# EAGLE design comcon_ps2_joy_adapter (EAGLE 6.5.0)
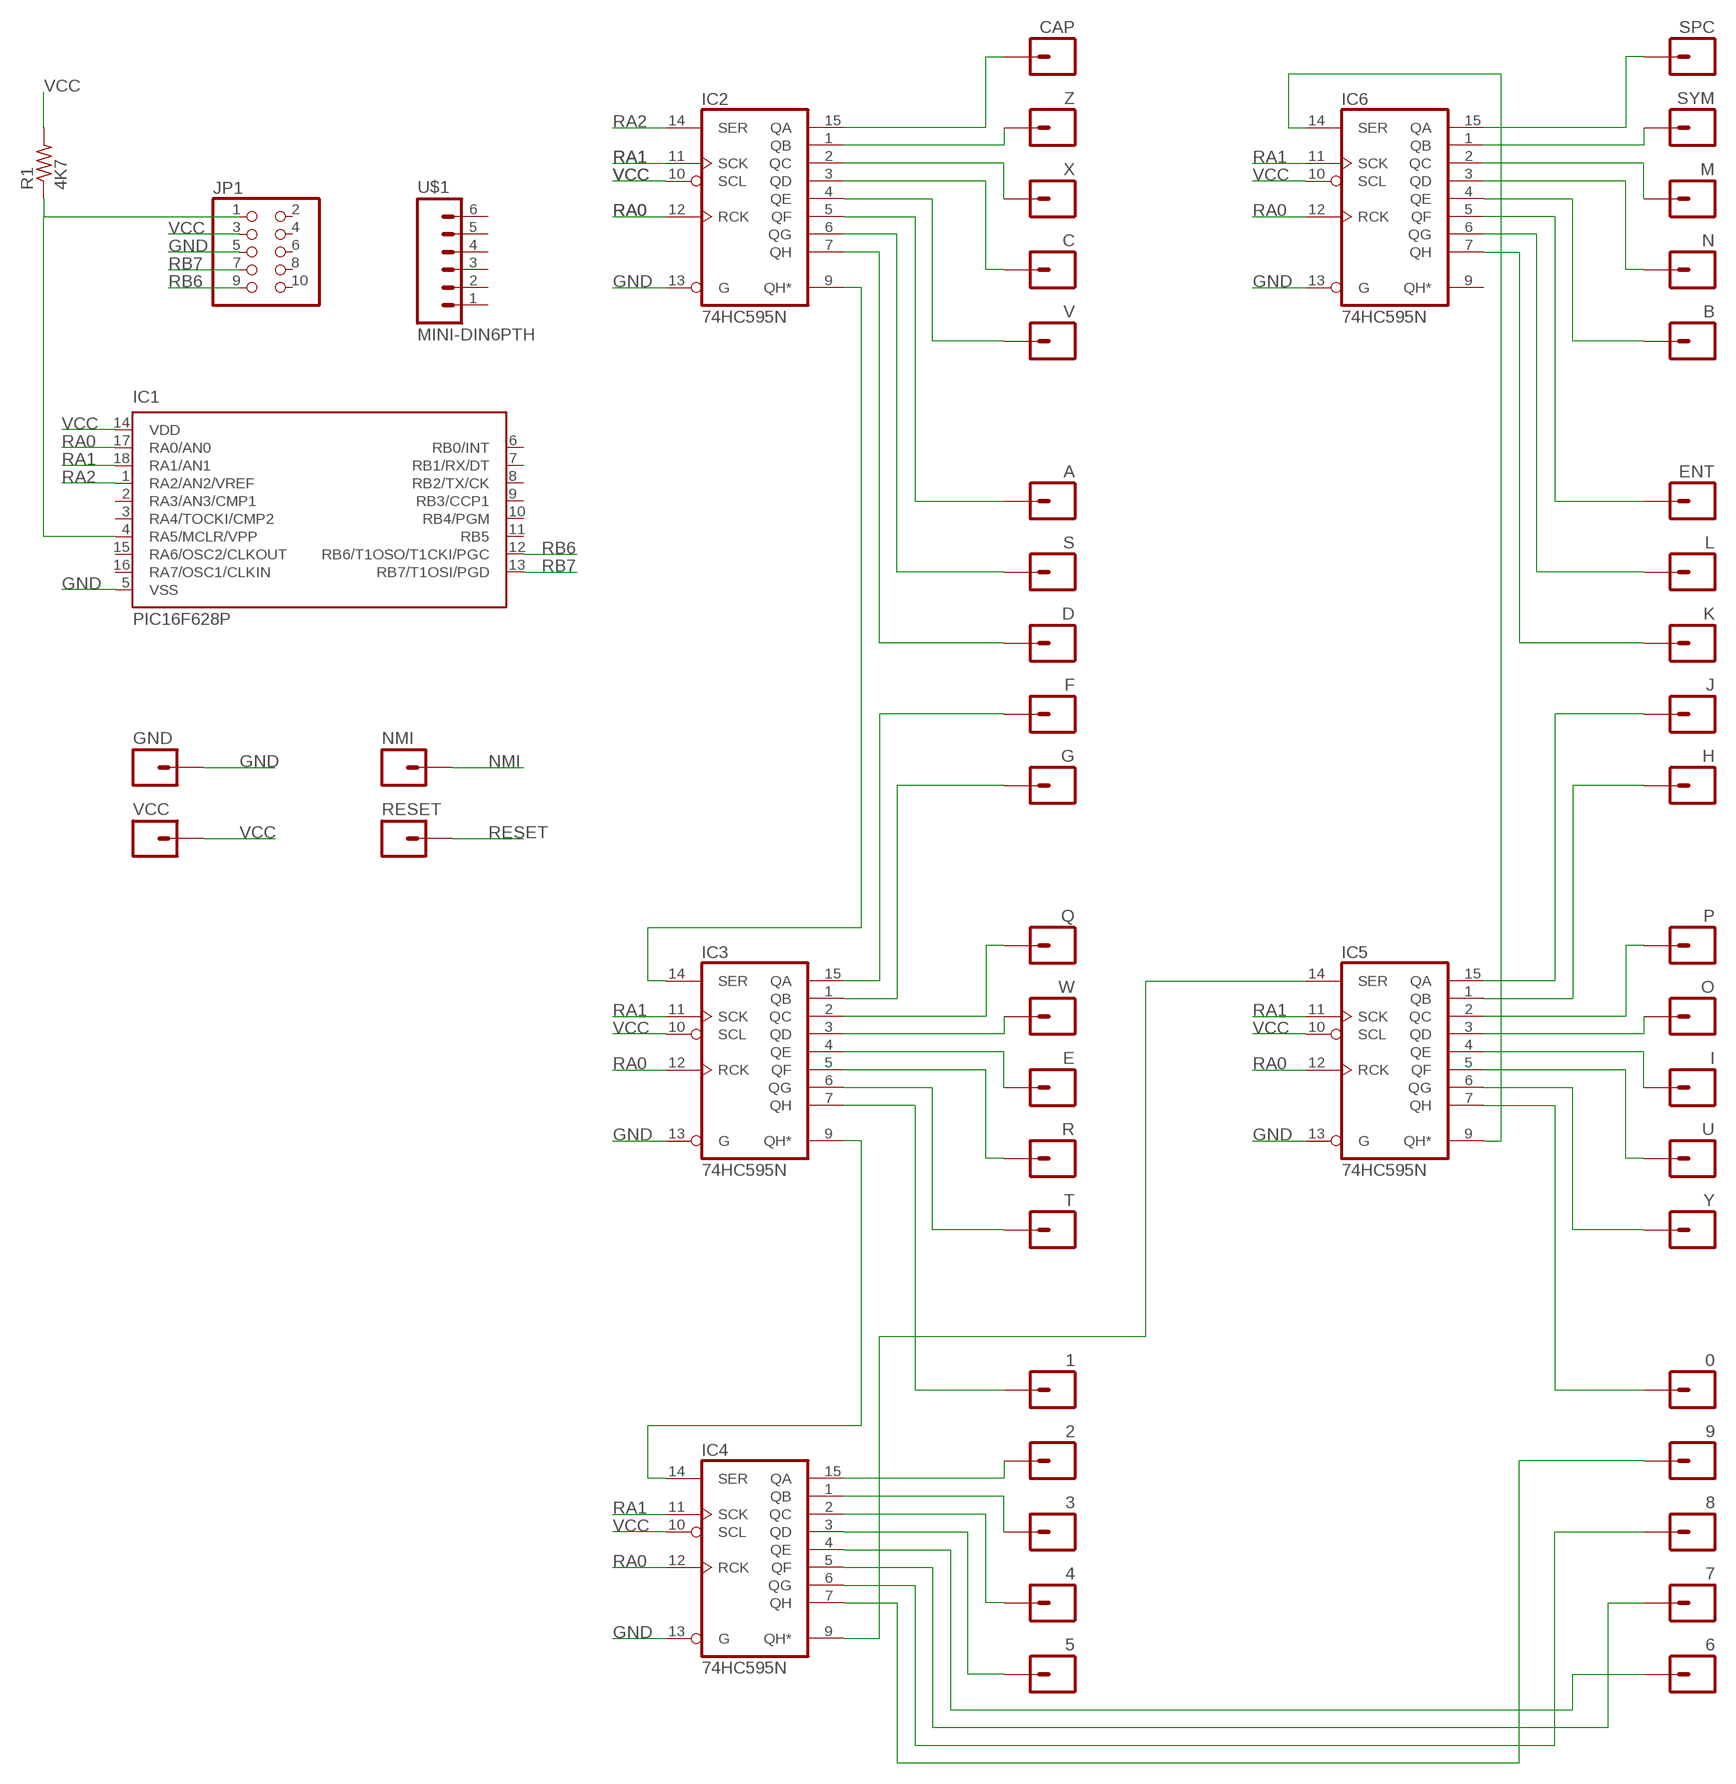
[diagram p0: schematic, sheet 1]

## Parts
0  M01PTH  [1X01]
1  M01PTH  [1X01]
2  M01PTH  [1X01]
3  M01PTH  [1X01]
4  M01PTH  [1X01]
5  M01PTH  [1X01]
6  M01PTH  [1X01]
7  M01PTH  [1X01]
8  M01PTH  [1X01]
9  M01PTH  [1X01]
A  M01PTH  [1X01]
B  M01PTH  [1X01]
C  M01PTH  [1X01]
CAP  M01PTH  [1X01]
D  M01PTH  [1X01]
E  M01PTH  [1X01]
ENT  M01PTH  [1X01]
F  M01PTH  [1X01]
G  M01PTH  [1X01]
GND  M01PTH  [1X01]
H  M01PTH  [1X01]
I  M01PTH  [1X01]
IC1  PIC16F628P  [DIL18]
IC2  74HC595N  [DIL16]
IC3  74HC595N  [DIL16]
IC4  74HC595N  [DIL16]
IC5  74HC595N  [DIL16]
IC6  74HC595N  [DIL16]
J  M01PTH  [1X01]
JP1  PINHD-2X5  [2X05]
K  M01PTH  [1X01]
L  M01PTH  [1X01]
M  M01PTH  [1X01]
N  M01PTH  [1X01]
NMI  M01PTH  [1X01]
O  M01PTH  [1X01]
P  M01PTH  [1X01]
Q  M01PTH  [1X01]
R  M01PTH  [1X01]
R1  4K7  R-US_0207/7  [0207/7]
RESET  M01PTH  [1X01]
S  M01PTH  [1X01]
SPC  M01PTH  [1X01]
SYM  M01PTH  [1X01]
T  M01PTH  [1X01]
U  M01PTH  [1X01]
U$1  MINI-DIN6PTH  [MINI-DIN6]
V  M01PTH  [1X01]
VCC  M01PTH  [1X01]
W  M01PTH  [1X01]
X  M01PTH  [1X01]
Y  M01PTH  [1X01]
Z  M01PTH  [1X01]

## Nets
GND [power]: GND.1 IC1.5(VSS) IC2.13(G) IC3.13(G) IC4.13(G) IC5.13(G) IC6.13(G) JP1.5
N$1: A.1 IC2.5(QF)
N$2: IC6.15(QA)
N$3: IC2.6(QG) S.1
N$4: IC2.9(QH*) IC3.14(SER)
N$5: IC5.9(QH*) IC6.14(SER)
N$6: IC3.9(QH*) IC4.14(SER)
N$7: IC4.9(QH*) IC5.14(SER)
N$8: IC1.4(RA5/MCLR/VPP) JP1.1 R1.1
N$12: IC6.1(QB) SYM.1
N$18: IC6.2(QC) M.1
N$20: IC6.3(QD) N.1
N$22: B.1 IC6.4(QE)
N$25: CAP.1 IC2.15(QA)
N$26: IC2.1(QB) Z.1
N$27: IC2.2(QC) X.1
N$28: C.1 IC2.3(QD)
N$47: IC2.4(QE) V.1
N$53: ENT.1 IC6.5(QF)
N$54: IC6.6(QG) L.1
N$55: IC6.7(QH) K.1
N$56: IC5.15(QA) J.1
N$57: H.1 IC5.1(QB)
N$65: D.1 IC2.7(QH)
N$66: F.1 IC3.15(QA)
N$67: G.1 IC3.1(QB)
N$74: IC5.2(QC)
N$75: IC5.3(QD) O.1
N$76: I.1 IC5.4(QE)
N$77: IC5.5(QF) U.1
N$78: IC5.6(QG) Y.1
N$84: IC3.2(QC)
N$85: IC3.3(QD) W.1
N$86: E.1 IC3.4(QE)
N$87: IC3.5(QF) R.1
N$88: IC3.6(QG) T.1
N$94: 0.1 IC5.7(QH)
N$95: 9.1 IC4.7(QH)
N$96: 8.1 IC4.6(QG)
N$97: 7.1 IC4.5(QF)
N$98: 6.1 IC4.4(QE)
N$104: 1.1 IC3.7(QH)
N$105: 2.1 IC4.15(QA)
N$106: 3.1 IC4.1(QB)
N$107: 4.1 IC4.2(QC)
N$108: 5.1 IC4.3(QD)
NMI: NMI.1
RA0: IC2.12(RCK) IC3.12(RCK) IC4.12(RCK) IC5.12(RCK) IC6.12(RCK)
RA1: IC2.11(SCK) IC3.11(SCK) IC4.11(SCK) IC5.11(SCK) IC6.11(SCK)
RA2: IC2.14(SER)
RB6: IC1.12(RB6/T1OSO/T1CKI/PGC)
RB7: IC1.13(RB7/T1OSI/PGD)
RESET: RESET.1
VCC [power]: IC2.10(SCL) IC3.10(SCL) IC4.10(SCL) IC5.10(SCL) IC6.10(SCL) JP1.3 R1.2 VCC.1
Unconnected: IC1.1(RA2/AN2/VREF) IC1.2(RA3/AN3/CMP1) IC1.3(RA4/TOCKI/CMP2) IC1.6(RB0/INT) IC1.7(RB1/RX/DT) IC1.8(RB2/TX/CK) IC1.9(RB3/CCP1) IC1.10(RB4/PGM) IC1.11(RB5) IC1.15(RA6/OSC2/CLKOUT) IC1.16(RA7/OSC1/CLKIN) IC1.17(RA0/AN0) IC1.18(RA1/AN1) IC6.9(QH*) JP1.2 JP1.4 JP1.6 JP1.7 JP1.8 JP1.9 JP1.10 P.1 Q.1 SPC.1 U$1.1 U$1.2 U$1.3 U$1.4 U$1.5 U$1.6

## Power pins joined to a net without a drawn wire
GND: IC2.8(GND) IC3.8(GND) IC4.8(GND) IC5.8(GND) IC6.8(GND)
VCC: IC2.16(VCC) IC3.16(VCC) IC4.16(VCC) IC5.16(VCC) IC6.16(VCC)
VDD: IC1.14(VDD)

## Library data of the parts
0 1-9 A B C CAP D E ENT F G GND H I J K L M N NMI O P Q R RESET S SPC SYM T U V VCC W X Y Z = SparkFun-Connectors:M01: Header 1 Standard 1-pin 0.1" header. Use with straight break away headers (SKU : PRT-00116), right angle break away headers (PRT-00553), swiss pins (PRT-00743), machine pins (PRT-00117), and female headers (PRT-00115).
IC1 = microchip:PIC16F62*: FLASH-Based 8-Bit CMOS Microcontroller Source: http://ww1.microchip.com/downloads/en/DeviceDoc/40300C.pdf; MF: MICROCHIP; MPN: PIC16F628-04I/P; OC_FARNELL: 9760407; OC_NEWARK: 19C7272
IC2-IC6 = 74xx-eu:74*595: 8-bit SHIFT REGISTER, output latch
JP1 = pinhead:PINHD-2X5: PIN HEADER
R1 = resistor:R-US_: RESISTOR, American symbol
U$1 = SparkFun-Connectors:MINI-DIN6: mini DIN 6 Connector Commonly found on the back of a computer for PS2 keyboard and mice. Schematic and footprint are proven. Spark Fun Electronics SKU : PRT-08509

## Net classes
1 power: width 0.508 mm, clearance 0.254 mm to class 0, clearance 0.254 mm

## Board
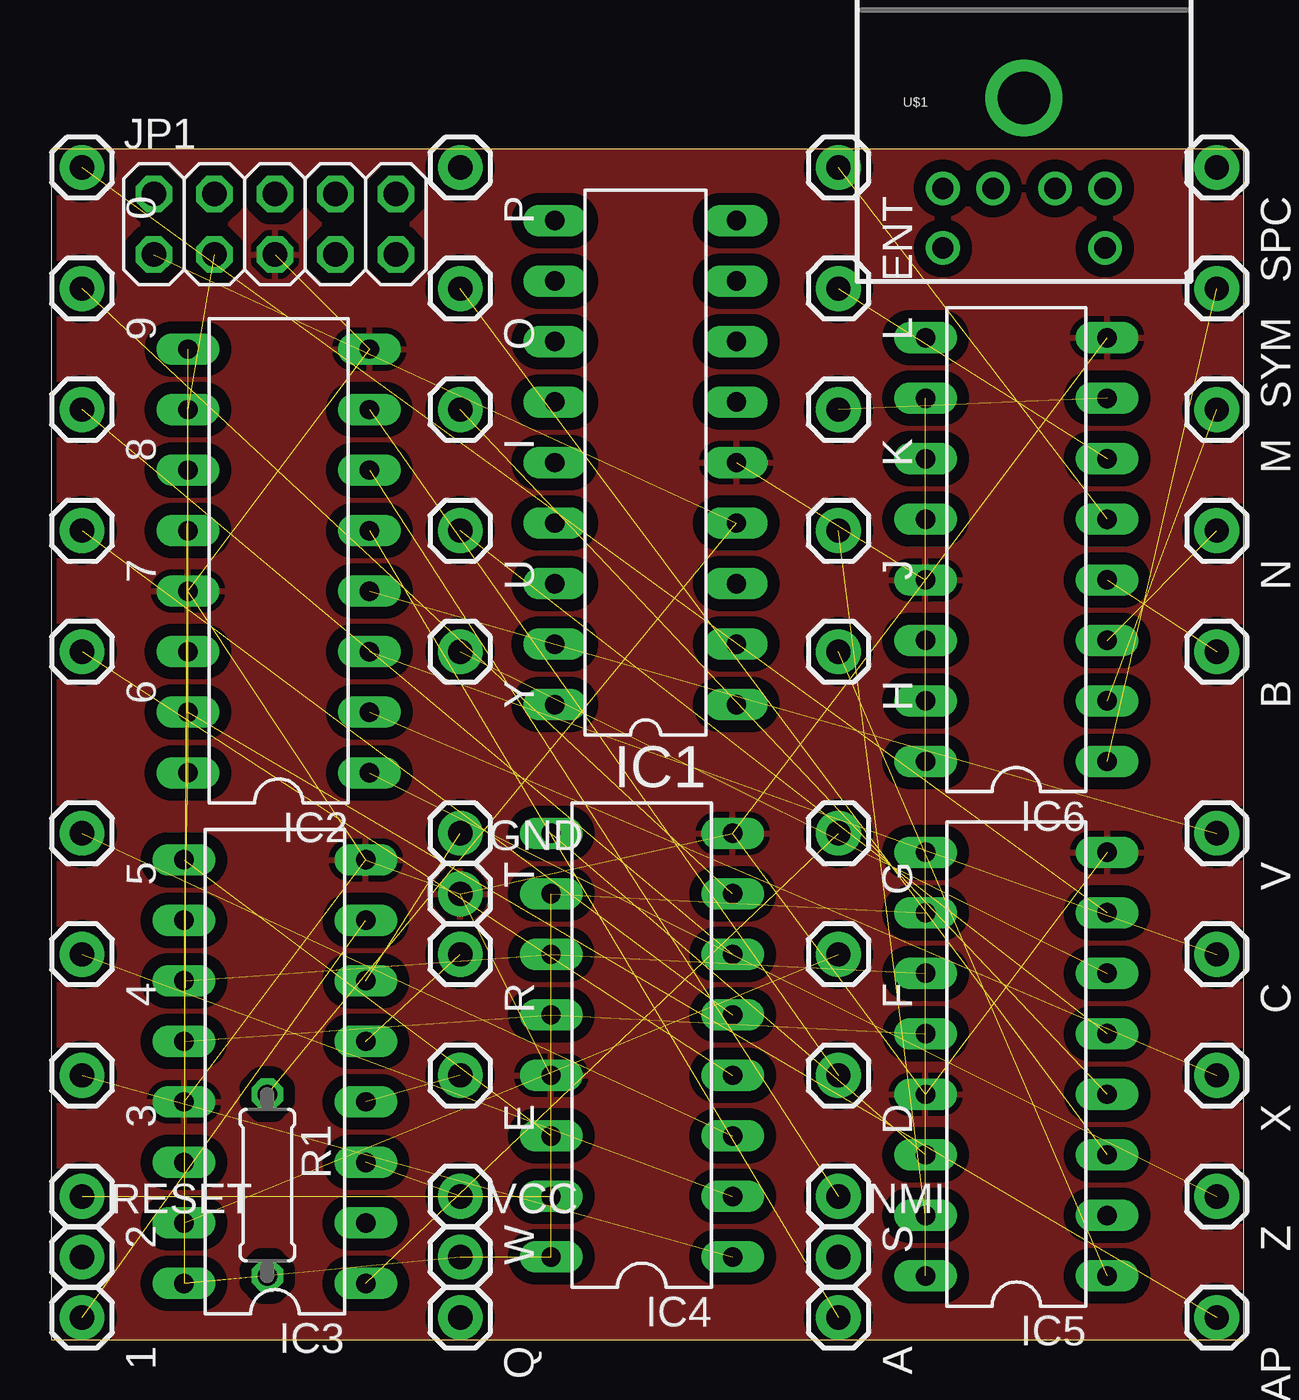
[diagram p1: board, top side]
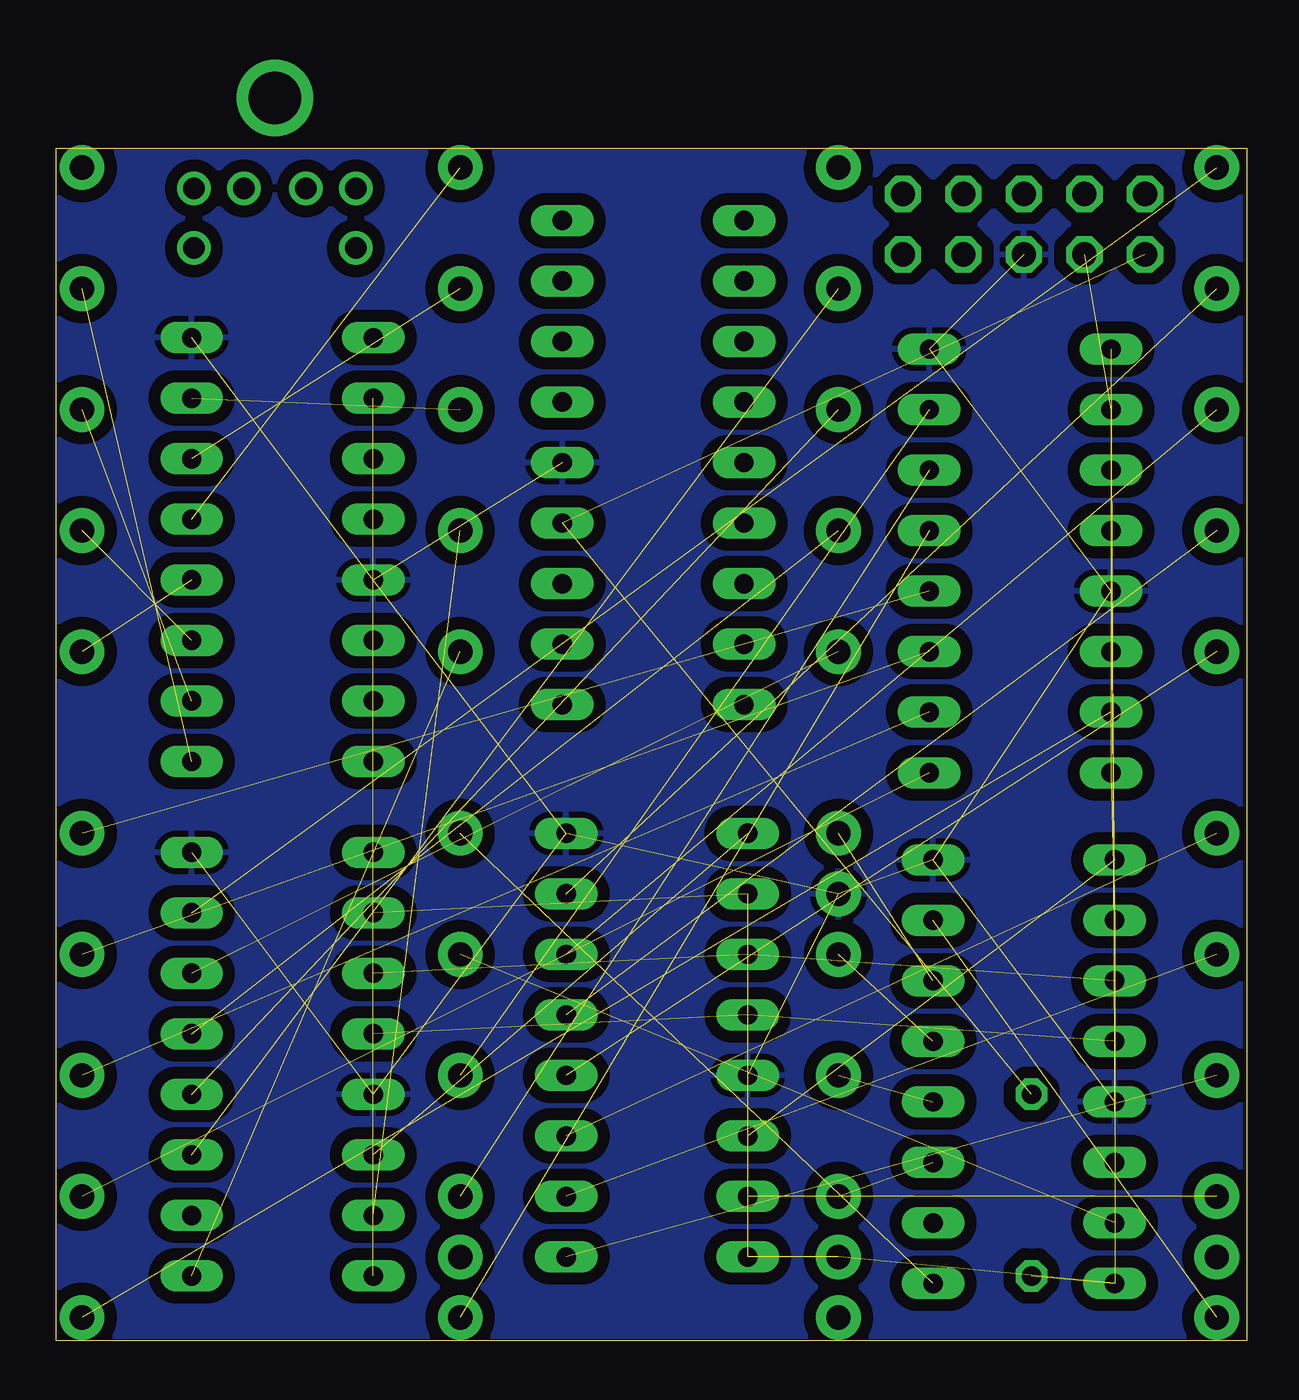
[diagram p2: board, bottom side, seen from below]

No outline drawn. Coordinates in mm, seen from the top.
Copper layers (1*16): Top 0.035mm / dielectric 1.5mm / Bottom 0.035mm
Design rules "seedstudio_Fusion_eagle_rule_v1.1 *": minimum track width 7mil, minimum drill 12mil, track to track 8mil, track to pad 10mil, pad to pad 6mil, via to via 10mil, smd to smd 0mil, copper to edge 10mil, drill to drill 10mil, minimum pad ring 10mil, minimum via ring 6mil, stop-mask expansion 2mil, vias tented up to drill 100mil, thermal gap 10mil
Milling: 4 lines

### Footprints (pad centres in the part's own frame; a part is rotated, then mirrored left to right if it is on the bottom)
1X01 = drill 1.016 pad 1.88: 1 0,0
DIL18 = drill 0.813 long: 1 -10.16,-3.81; 2 -7.62,-3.81; 3 -5.08,-3.81; 4 -2.54,-3.81; 5 0,-3.81; 6 2.54,-3.81; 7 5.08,-3.81; 8 7.62,-3.81; 9 10.16,-3.81; 10 10.16,3.81; 11 7.62,3.81; 12 5.08,3.81; 13 2.54,3.81; 14 0,3.81; 15 -2.54,3.81; 16 -5.08,3.81; 17 -7.62,3.81; 18 -10.16,3.81
DIL16 = drill 0.813 long: 1 -8.89,-3.81; 2 -6.35,-3.81; 3 -3.81,-3.81; 4 -1.27,-3.81; 5 1.27,-3.81; 6 3.81,-3.81; 7 6.35,-3.81; 8 8.89,-3.81; 9 8.89,3.81; 10 6.35,3.81; 11 3.81,3.81; 12 1.27,3.81; 13 -1.27,3.81; 14 -3.81,3.81; 15 -6.35,3.81; 16 -8.89,3.81
2X05 = drill 1.016 octagon: 1 -5.08,-1.27; 2 -5.08,1.27; 3 -2.54,-1.27; 4 -2.54,1.27; 5 0,-1.27; 6 0,1.27; 7 2.54,-1.27; 8 2.54,1.27; 9 5.08,-1.27; 10 5.08,1.27
0207/7 = drill 0.813 octagon: 1 -3.81,0; 2 3.81,0
MINI-DIN6 = drill 0.9: 1 -1.3,-8.5; 2 1.3,-8.5; 3 -3.4,-8.5; 4 3.4,-8.5; 5 -3.4,-11; 6 3.4,-11 | drill 2.2: P$1 0,-4.7

### Placement (x,y rotation side)
0  1.27,49.21 270 top
1  1.27,0.95 270 top
2  1.27,6.03 270 top
3  1.27,11.11 270 top
4  1.27,16.19 270 top
5  1.27,21.27 270 top
6  1.27,28.89 270 top
7  1.27,33.97 270 top
8  1.27,39.05 270 top
9  1.27,44.13 270 top
A  33.02,0.95 270 top
B  48.9,28.89 270 top
C  48.9,16.19 270 top
CAP  48.9,0.95 270 top
D  33.02,11.11 270 top
E  17.14,11.11 270 top
ENT  33.02,49.21 270 top
F  33.02,16.19 270 top
G  33.02,21.27 270 top
GND  17.14,18.73 0 top
H  33.02,28.89 270 top
I  17.14,39.05 270 top
IC1  24.92,36.83 90 top
IC2  9.53,32.7 90 top
IC3  9.37,11.27 90 top
IC4  24.77,12.38 90 top
IC5  40.48,11.59 90 top
IC6  40.48,33.18 90 top
J  33.02,33.97 270 top
JP1  9.37,46.83 0 top
K  33.02,39.05 270 top
L  33.02,44.13 270 top
M  48.9,39.05 270 top
N  48.9,33.97 270 top
NMI  33.02,3.49 0 top
O  17.14,44.13 270 top
P  17.14,49.21 270 top
Q  17.14,0.95 270 top
R  17.14,16.19 270 top
R1  9.05,6.51 270 top
RESET  1.27,3.49 0 top
S  33.02,6.03 270 top
SPC  48.9,49.21 270 top
SYM  48.9,44.13 270 top
T  17.14,21.27 270 top
U  17.14,33.97 270 top
U$1  40.8,56.83 0 top
V  48.9,21.27 270 top
VCC  17.14,3.49 0 top
W  17.14,6.03 270 top
X  48.9,11.11 270 top
Y  17.14,28.89 270 top
Z  48.9,6.03 270 top

### Tracks (layer width: path | path; a pad name or v marks a point on that pad's centre or on a via)
GND  (12 unrouted)
  pour Top (isolate 0.508): 0.32,0.16 49.85,0.16 49.85,49.85 0.32,49.85
  pour Bottom (isolate 0.508): 0.32,0.16 49.85,0.16 49.85,49.85 0.32,49.85
N$1  (1 unrouted)
N$3  (1 unrouted)
N$4  (1 unrouted)
N$5  (1 unrouted)
N$6  (1 unrouted)
N$7  (1 unrouted)
N$8  (2 unrouted)
N$12  (1 unrouted)
N$18  (1 unrouted)
N$20  (1 unrouted)
N$22  (1 unrouted)
N$25  (1 unrouted)
N$26  (1 unrouted)
N$27  (1 unrouted)
N$28  (1 unrouted)
N$47  (1 unrouted)
N$53  (1 unrouted)
N$54  (1 unrouted)
N$55  (1 unrouted)
N$56  (1 unrouted)
N$57  (1 unrouted)
N$65  (1 unrouted)
N$66  (1 unrouted)
N$67  (1 unrouted)
N$75  (1 unrouted)
N$76  (1 unrouted)
N$77  (1 unrouted)
N$78  (1 unrouted)
N$85  (1 unrouted)
N$86  (1 unrouted)
N$87  (1 unrouted)
N$88  (1 unrouted)
N$94  (1 unrouted)
N$95  (1 unrouted)
N$96  (1 unrouted)
N$97  (1 unrouted)
N$98  (1 unrouted)
N$104  (1 unrouted)
N$105  (1 unrouted)
N$106  (1 unrouted)
N$107  (1 unrouted)
N$108  (1 unrouted)
RA0  (4 unrouted)
RA1  (4 unrouted)
VCC  (12 unrouted)